# Altium schematic sheet M-LVDS_PHY.SchDoc: RFSoC_AMC
size 420 x 297 mm; Author: T. Przywozki; CompanyName: WUT ISE; DrawnBy: T. Przywozki; Organization: WUT ISE; Address1: PW ISE; Address2: Nowowiejska 15/19 00-665 Warsaw; Revision: 1.0; SheetNumber: 29; ModifiedBy: -; CheckedDate: -; Title2: 8 channel ADC & DAC; DivGrp: WUT ISE; Designer: T. Przywozki
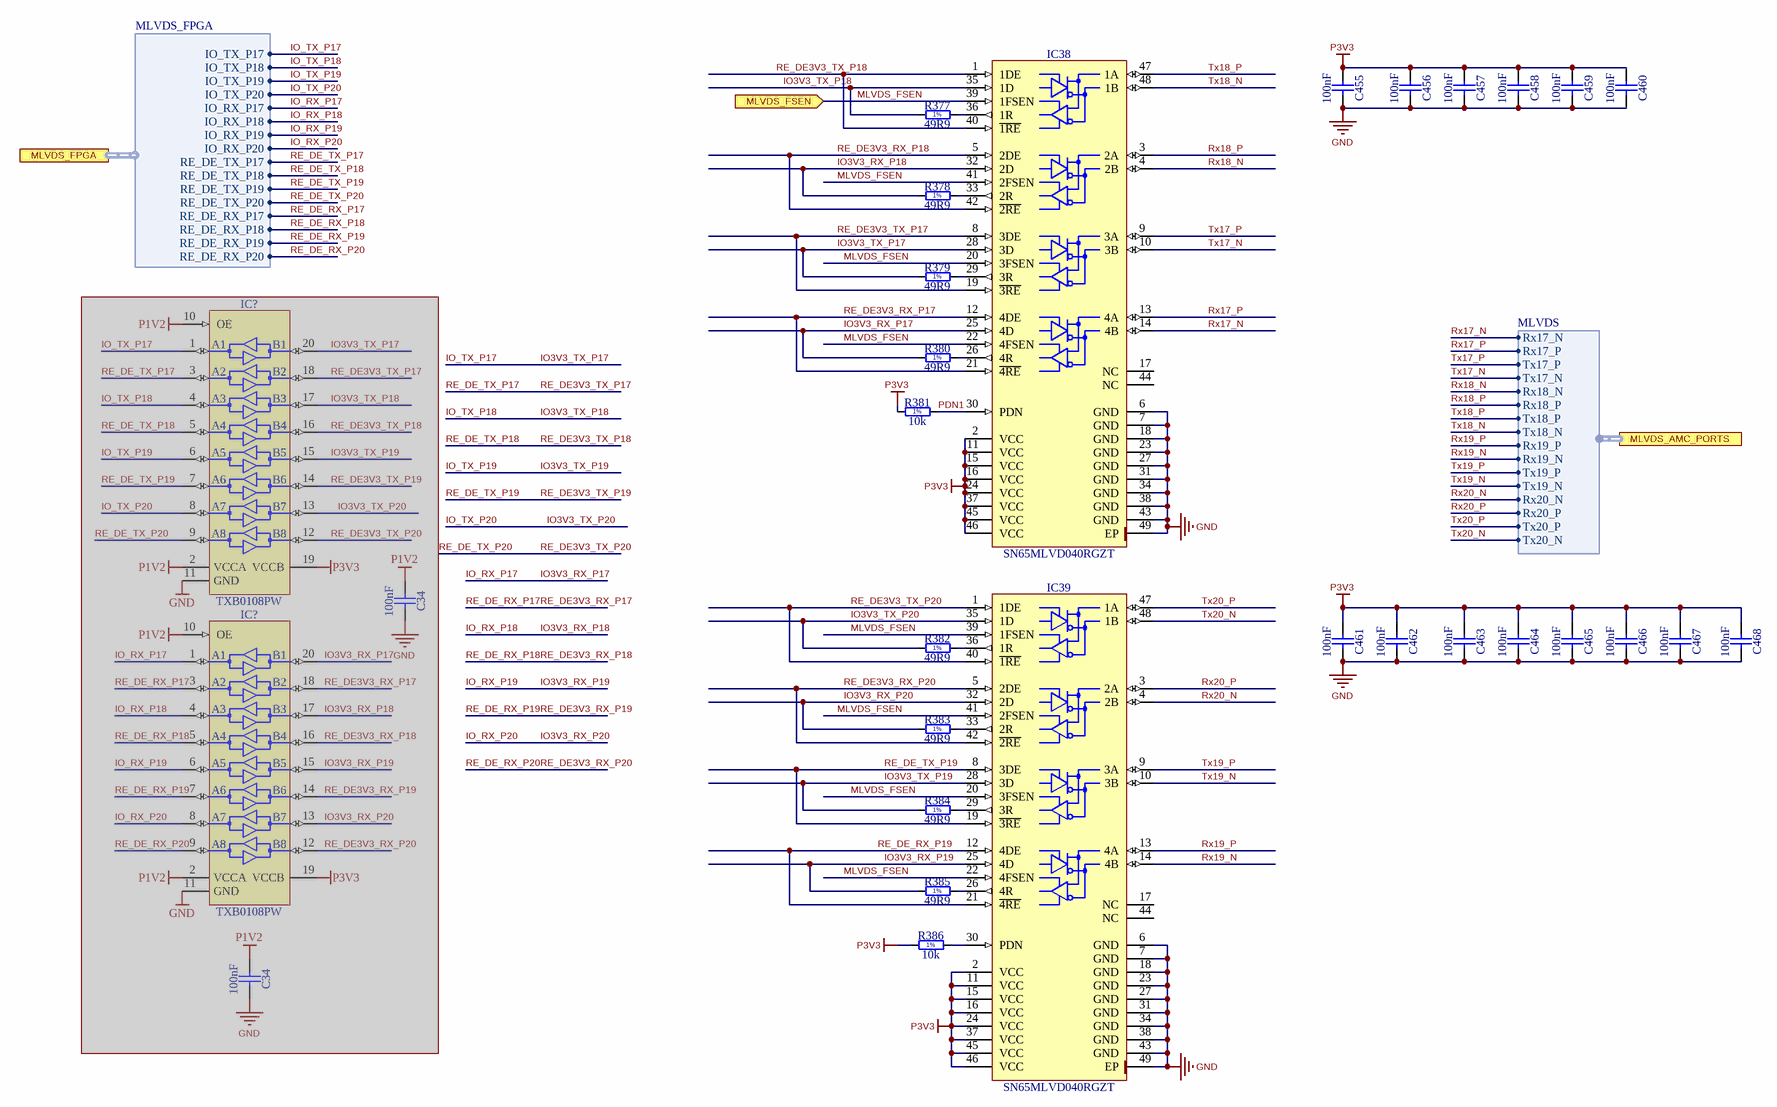
[diagram p0: M-LVDS_PHY.SchDoc]

## Parts
(Parts that share a designator on the sheet are numbered #1, #2 ... from top to bottom, then left to right.)
C34#1  100nF  [CAPC0603X33N]  (masked out: inside a compile mask, not in the netlist)
C34#2  100nF  [CAPC0603X33N]  (masked out: inside a compile mask, not in the netlist)
C455  100nF  [CAPC0603X33N]
C456  100nF  [CAPC0603X33N]
C457  100nF  [CAPC0603X33N]
C458  100nF  [CAPC0603X33N]
C459  100nF  [CAPC0603X33N]
C460  100nF  [CAPC0603X33N]
C461  100nF  [CAPC0603X33N]
C462  100nF  [CAPC0603X33N]
C463  100nF  [CAPC0603X33N]
C464  100nF  [CAPC0603X33N]
C465  100nF  [CAPC0603X33N]
C466  100nF  [CAPC0603X33N]
C467  100nF  [CAPC0603X33N]
C468  100nF  [CAPC0603X33N]
IC38  SN65MLVD040RGZT  [QFN50P700X700X100-49N-S420]
IC39  SN65MLVD040RGZT  [QFN50P700X700X100-49N-S420]
IC?#1  TXB0108PW  [SOP65P640X120-20N]  (masked out: inside a compile mask, not in the netlist)
IC?#2  TXB0108PW  [SOP65P640X120-20N]  (masked out: inside a compile mask, not in the netlist)
R377  49R9  [RESC1005X40N]
R378  49R9  [RESC1005X40N]
R379  49R9  [RESC1005X40N]
R380  49R9  [RESC1005X40N]
R381  10k  [RESC1005X40N]
R382  49R9  [RESC1005X40N]
R383  49R9  [RESC1005X40N]
R384  49R9  [RESC1005X40N]
R385  49R9  [RESC1005X40N]
R386  10k  [RESC1005X40N]

## Ports
MLVDS_AMC_PORTS (harness MLVDS), MLVDS_FPGA (harness MLVDS_FPGA), MLVDS_FSEN (in)

## Harnesses
MLVDS_FPGA: IO_TX_P17, IO_TX_P18, IO_TX_P19, IO_TX_P20, IO_RX_P17, IO_RX_P18, IO_RX_P19, IO_RX_P20, RE_DE_TX_P17, RE_DE_TX_P18, RE_DE_TX_P19, RE_DE_TX_P20, RE_DE_RX_P17, RE_DE_RX_P18, RE_DE_RX_P19, RE_DE_RX_P20
MLVDS: Rx17_N, Rx17_P, Tx17_P, Tx17_N, Rx18_N, Rx18_P, Tx18_P, Tx18_N, Rx19_P, Rx19_N, Tx19_P, Tx19_N, Rx20_N, Rx20_P, Tx20_P, Tx20_N

## Nets
GND: C455.2 C456.2 C457.2 C458.2 C459.2 C460.2 C461.2 C462.2 C463.2 C464.2 C465.2 C466.2 C467.2 C468.2 IC38.6(GND) IC38.7(GND) IC38.18(GND) IC38.23(GND) IC38.27(GND) IC38.31(GND) IC38.34(GND) IC38.38(GND) IC38.43(GND) IC38.49(EP) IC39.6(GND) IC39.7(GND) IC39.18(GND) IC39.23(GND) IC39.27(GND) IC39.31(GND) IC39.34(GND) IC39.38(GND) IC39.43(GND) IC39.49(EP)
P3V3: C455.1 C456.1 C457.1 C458.1 C459.1 C460.1 C461.1 C462.1 C463.1 C464.1 C465.1 C466.1 C467.1 C468.1 IC38.2(VCC) IC38.11(VCC) IC38.15(VCC) IC38.16(VCC) IC38.24(VCC) IC38.37(VCC) IC38.45(VCC) IC38.46(VCC) IC39.2(VCC) IC39.11(VCC) IC39.15(VCC) IC39.16(VCC) IC39.24(VCC) IC39.37(VCC) IC39.45(VCC) IC39.46(VCC) R381.1 R386.1
IO3V3_RX_P17: IC38.25(4D) R380.1 ; port MLVDS_FPGA.IO_RX_P17  [also labelled IO_RX_P17]
IO3V3_RX_P18: IC38.32(2D) R378.1 ; port MLVDS_FPGA.IO_RX_P18  [also labelled IO_RX_P18]
IO3V3_RX_P19: IC39.25(4D) R385.1 ; port MLVDS_FPGA.IO_RX_P19  [also labelled IO_RX_P19]
IO3V3_RX_P20: IC39.32(2D) R383.1 ; port MLVDS_FPGA.IO_RX_P20  [also labelled IO_RX_P20]
IO3V3_TX_P17: IC38.28(3D) R379.1 ; port MLVDS_FPGA.IO_TX_P17  [also labelled IO_TX_P17]
IO3V3_TX_P18: IC38.35(1D) R377.1 ; port MLVDS_FPGA.IO_TX_P18  [also labelled IO_TX_P18]
IO3V3_TX_P19: IC39.28(3D) R384.1 ; port MLVDS_FPGA.IO_TX_P19  [also labelled IO_TX_P19]
IO3V3_TX_P20: IC39.35(1D) R382.1 ; port MLVDS_FPGA.IO_TX_P20  [also labelled IO_TX_P20]
MLVDS_FSEN: IC38.20(3FSEN) IC38.22(4FSEN) IC38.39(1FSEN) IC38.41(2FSEN) IC39.20(3FSEN) IC39.22(4FSEN) IC39.39(1FSEN) IC39.41(2FSEN) ; port MLVDS_FSEN
PDN1: IC38.30(PDN) R381.2
RE_DE3V3_RX_P17: IC38.12(4DE) IC38.21(~{4RE}) ; port MLVDS_FPGA.RE_DE_RX_P17  [also labelled RE_DE_RX_P17]
RE_DE3V3_RX_P18: IC38.5(2DE) IC38.42(~{2RE}) ; port MLVDS_FPGA.RE_DE_RX_P18  [also labelled RE_DE_RX_P18]
RE_DE3V3_RX_P19: IC39.12(4DE) IC39.21(~{4RE}) ; port MLVDS_FPGA.RE_DE_RX_P19  [also labelled RE_DE_RX_P19]
RE_DE3V3_RX_P20: IC39.5(2DE) IC39.42(~{2RE}) ; port MLVDS_FPGA.RE_DE_RX_P20  [also labelled RE_DE_RX_P20]
RE_DE3V3_TX_P17: IC38.8(3DE) IC38.19(~{3RE}) ; port MLVDS_FPGA.RE_DE_TX_P17  [also labelled RE_DE_TX_P17]
RE_DE3V3_TX_P18: IC38.1(1DE) IC38.40(~{1RE}) ; port MLVDS_FPGA.RE_DE_TX_P18  [also labelled RE_DE_TX_P18]
RE_DE3V3_TX_P19: IC39.8(3DE) IC39.19(~{3RE}) ; port MLVDS_FPGA.RE_DE_TX_P19  [also labelled RE_DE_TX_P19]
RE_DE3V3_TX_P20: IC39.1(1DE) IC39.40(~{1RE})
RE_DE_TX_P20: port MLVDS_FPGA.RE_DE_TX_P20
Rx17_N: IC38.14(4B) ; port MLVDS_AMC_PORTS.Rx17_N
Rx17_P: IC38.13(4A) ; port MLVDS_AMC_PORTS.Rx17_P
Rx18_N: IC38.4(2B) ; port MLVDS_AMC_PORTS.Rx18_N
Rx18_P: IC38.3(2A) ; port MLVDS_AMC_PORTS.Rx18_P
Rx19_N: IC39.14(4B) ; port MLVDS_AMC_PORTS.Rx19_N
Rx19_P: IC39.13(4A) ; port MLVDS_AMC_PORTS.Rx19_P
Rx20_N: IC39.4(2B) ; port MLVDS_AMC_PORTS.Rx20_N
Rx20_P: IC39.3(2A) ; port MLVDS_AMC_PORTS.Rx20_P
Tx17_N: IC38.10(3B) ; port MLVDS_AMC_PORTS.Tx17_N
Tx17_P: IC38.9(3A) ; port MLVDS_AMC_PORTS.Tx17_P
Tx18_N: IC38.48(1B) ; port MLVDS_AMC_PORTS.Tx18_N
Tx18_P: IC38.47(1A) ; port MLVDS_AMC_PORTS.Tx18_P
Tx19_N: IC39.10(3B) ; port MLVDS_AMC_PORTS.Tx19_N
Tx19_P: IC39.9(3A) ; port MLVDS_AMC_PORTS.Tx19_P
Tx20_N: IC39.48(1B) ; port MLVDS_AMC_PORTS.Tx20_N
Tx20_P: IC39.47(1A) ; port MLVDS_AMC_PORTS.Tx20_P
NetIC38_26: IC38.26(4R) R380.2
NetIC38_29: IC38.29(3R) R379.2
NetIC38_33: IC38.33(2R) R378.2
NetIC38_36: IC38.36(1R) R377.2
NetIC39_26: IC39.26(4R) R385.2
NetIC39_29: IC39.29(3R) R384.2
NetIC39_30: IC39.30(PDN) R386.2
NetIC39_33: IC39.33(2R) R383.2
NetIC39_36: IC39.36(1R) R382.2

Not connected (* = marked no-connect by the designer): IC38 17(NC) 44(NC); IC39 17(NC) 44(NC)

## Notes on the sheet
- Project/Equipment
- Document
- Designer
- Drawn by
- Check.by
- Copyright WUT ISE 2019.
  This documentation describes Open Hardware and is licensed under the CERN OHL v.1.1. You may redistribute and modify this documentation under the terms of the CERN OHL v.1.1. (http://ohwr.org/CERNOHL). This documentation is distributed WITHOUT ANY EXPRESS OR IMPLIED WARRANTY, INCLUDING OF MERCHANTABILITY, SATISFACTORY QUALITY AND FITNESS FOR A PARTICULAR PURPOSE. Please see the CERN OHL v.1.1 for applicable conditions.
- Contact
- File
- Last Mod.
- Print Date
- Sheet
- Size
- A3
- of
- Rev
- (in symbol R0402_10K_1%_0.0625W_100PPM) 1%
- (in symbol R0402_49R9_1%_0.0625W_100PPM) 1%
- (in symbol TXB0108PW) VCCA; VCCB

## Library data of the parts
C34#1 C34#2 C455-C468 = CC0201_100NF_6.3V_10%_X5R: Non-polarised capacitor; Manufacturer: GENERIC; Part Description: SMD Multilayer Chip Ceramic Capacitor; Manufacturer1 Part Number: 02016D104KAT2A; Tolerance: ±10%; Voltage: 6.3V; TC: X5R; Manufacturer Part Number: CC0201_100NF_6.3V_10%_X5R; Part Number: CC0201_100NF_6.3V_10%_X5R; Value: 100nF; Component Kind: Standard; Component Type: Standard; Pin Count: 2; Status: Not Recommended; Case: 0201; Mounted: Yes; Socket: No; SMD: Yes; Sense: No; Manufacturer1 Example: AVX; Manufacturer1 ComponentHeight: 0.33mm; HelpURL: \\cern.ch\dfs\Applications\Altium\Datasheets\CC0201_X5R_AVX.pdf; Author: CERN DEM JLC; CreateDate: 03/12/2007; LatestRevisionDate: 03/12/2007
IC38 IC39 = SN65MLVD040RGZT: 4-Channel Half-Duplex M-LVDS Line Transceiver; Manufacturer: TEXAS INSTRUMENTS; PressFit: No; Bonding: No; Manufacturer Part Number: SN65MLVD040RGZT; PackageDescription: QFN, 0.50mm Pitch, Square; 48 Pin, 7.00mm L X 7.00mm W X 1mm H body (W/Thermal Tab 4.2mm X 4.2mm), IPC Medium Density; Part Description: 4-Channel Half-Duplex M-LVDS Line Transceiver; Part Number: SN65MLVD040RGZT; Component Kind: Standard; Component Type: Standard; Device: SN65MLVD040RGZT; Pin Count: 49; Case: QFN48; Mounted: Yes; Socket: No; SMD: Yes; Sense: No; ComponentHeight: 1mm; Author: CERN DEM JLC; HelpURL: \\cern.ch\dfs\Applications\Altium\Datasheets\SN65MLVD040RGZT.pdf; CreateDate: 17/03/2011; LatestRevisionDate: 17/03/2011
IC?#1 IC?#2 = TXB0108PW: 8-Bit Bidirectional Voltage-Level Translator with Automatic Direction Sensing and ±15kV ESD Protection; Manufacturer: TEXAS INSTRUMENTS; PressFit: No; Bonding: No; Part Number: TXB0108PW; Component Kind: Standard; Component Type: Standard; Device: TXB0108PW; PackageDescription: SOP, 20-Leads, Body 6.5x4.4mm, Pitch 0.65mm, IPC Medium Density; Part Description: 8-Bit Bidirectional Voltage-Level Translator with Automatic Direction Sensing and ±15kV ESD Protection; Manufacturer Part Number: TXB0108PW; Pin Count: 20; Case: TSSOP20; Mounted: Yes; Socket: No; SMD: Yes; Sense: No; ComponentHeight: 1.2mm; Author: CERN DEM MR; HelpURL: \\cern.ch\dfs\Applications\Altium\Datasheets\TXB0108PW.pdf; CreateDate: 01/04/2016; LatestRevisionDate: 01/04/2016
R377-R380 R382-R385 = R0402_49R9_1%_0.0625W_100PPM: Resistor - 1%; Manufacturer: GENERIC; Part Description: General Purpose Thick Film Chip Resistor; Manufacturer1 Part Number: 232270674999L or RC0402FR-0749R9L; TC: ±100ppm/°C; PressFit: No; Manufacturer Part Number: R0402_49R9_1%_0.0625W_100PPM; Part Number: R0402_49R9_1%_0.0625W_100PPM; Tolerance: ±1%; Value: 49R9; Component Kind: Standard; Component Type: Standard; Pin Count: 2; Status: Not Recommended; Power: 0.0625W; Case: 0402; Mounted: Yes; Sense: No; Socket: No; SMD: Yes; Manufacturer1 Example: YAGEO PHYCOMP; Manufacturer1 ComponentHeight: 0.4mm; HelpURL: \\cern.ch\dfs\Applications\Altium\Datasheets\R0402_Phycomp_RC0402.pdf; Author: CERN DEM JLC; CreateDate: 24/10/2012; LatestRevisionDate: 24/10/2012
R381 R386 = R0402_10K_1%_0.0625W_100PPM: Resistor - 1%; Manufacturer: GENERIC; Part Description: General Purpose Thick Film Chip Resistor; Manufacturer1 Part Number: 232270671003L; TC: ±100ppm/°C; PressFit: No; Manufacturer Part Number: R0402_10K_1%_0.0625W_100PPM; Part Number: R0402_10K_1%_0.0625W_100PPM; Tolerance: ±1%; Value: 10k; Component Kind: Standard; Component Type: Standard; Pin Count: 2; Status: Not Recommended; Power: 0.0625W; Case: 0402; Mounted: Yes; Sense: No; Socket: No; SMD: Yes; Manufacturer1 Example: YAGEO PHYCOMP; Manufacturer1 ComponentHeight: 0.4mm; HelpURL: \\cern.ch\dfs\Applications\Altium\Datasheets\R0402_Phycomp_RC0402.pdf; Author: CERN DEM JLC; CreateDate: 03/12/2007; LatestRevisionDate: 17/10/2012